# Altium schematic sheet MCU_Debug.SchDoc: Local MCU Debug Connector
size A4; DocumentNumber: 7; SheetNumber: 7; SheetTotal: 12
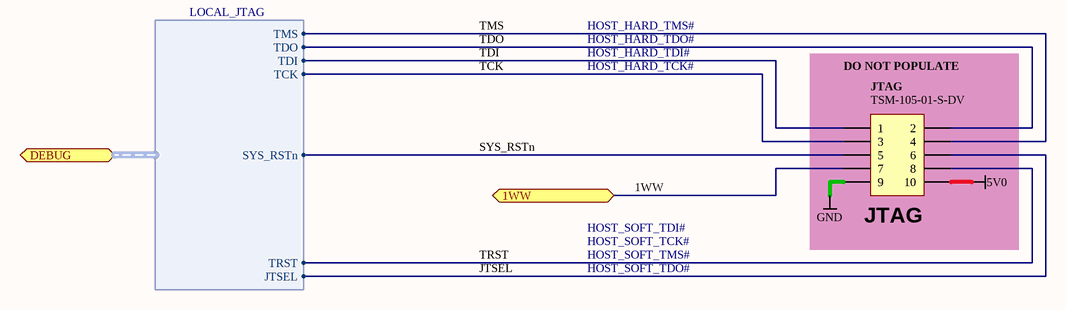
[diagram p0: MCU_Debug.SchDoc]

## Parts
JTAG  TSM-105-01-S-DV  [TSM-105-01-DV]  (no BOM)

## Blocks framed on the sheet
JTAG: JTAG

## Ports
1WW (bidir), DEBUG (harness LOCAL_JTAG)

## Harnesses
LOCAL_JTAG: TMS, TDO, TDI, TCK, SYS_RSTn, TRST, JTSEL

## Nets
5V0: JTAG.10
GND: JTAG.9
1WW: JTAG.7 ; port 1WW
JTSEL: JTAG.6 ; port DEBUG.JTSEL
SYS_RSTn: JTAG.5 ; port DEBUG.SYS_RSTn
TCK: JTAG.3 ; port DEBUG.TCK
TDI: JTAG.1 ; port DEBUG.TDI
TDO: JTAG.2 ; port DEBUG.TDO
TMS: JTAG.4 ; port DEBUG.TMS
TRST: JTAG.8 ; port DEBUG.TRST

## Notes on the sheet
- HOST_HARD_TMS#
- HOST_HARD_TDO#
- HOST_HARD_TDI#
- HOST_HARD_TCK#
- DO NOT POPULATE
- HOST_SOFT_TDI#
- HOST_SOFT_TCK#
- HOST_SOFT_TMS#
- HOST_SOFT_TDO#
- Sheet Title
- Project Title
- Size:
- Date:
- A4
- Assy:
- Time:
- Revision:
- Sheet
- of
- File:

## Library data of the parts
JTAG = D-300-0076: Non-Boxed Header IDC, 2 X 5 Pin SMD; Connector type: Boxed; Max Current: mA; Category: Connector; Mounting Technology: Surface Mount; Status: Unreleased